# EAGLE schematic PiezoAdapter (EAGLE 9.6.2)
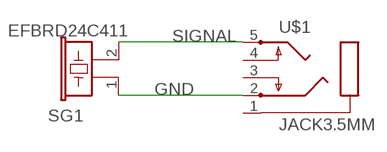
[diagram p0: schematic, sheet 1]

## Parts
SG1  EFBRD24C411  [EFBRD24C411]
U$1  JACK3.5MM  [PG203J]

## Nets
GND: SG1.1 U$1.2
SIGNAL: SG1.2 U$1.5
Unconnected: U$1.1 U$1.3 U$1.4

## Library data of the parts
SG1 = buzzer:EFB?: Piezoelectric Acoustic Transducer Source: Panbasonic .. 2SC1685.pdf; OC_FARNELL: unknown; OC_NEWARK: unknown
U$1 = Jack3.5mmConnector:JACK3.5MM